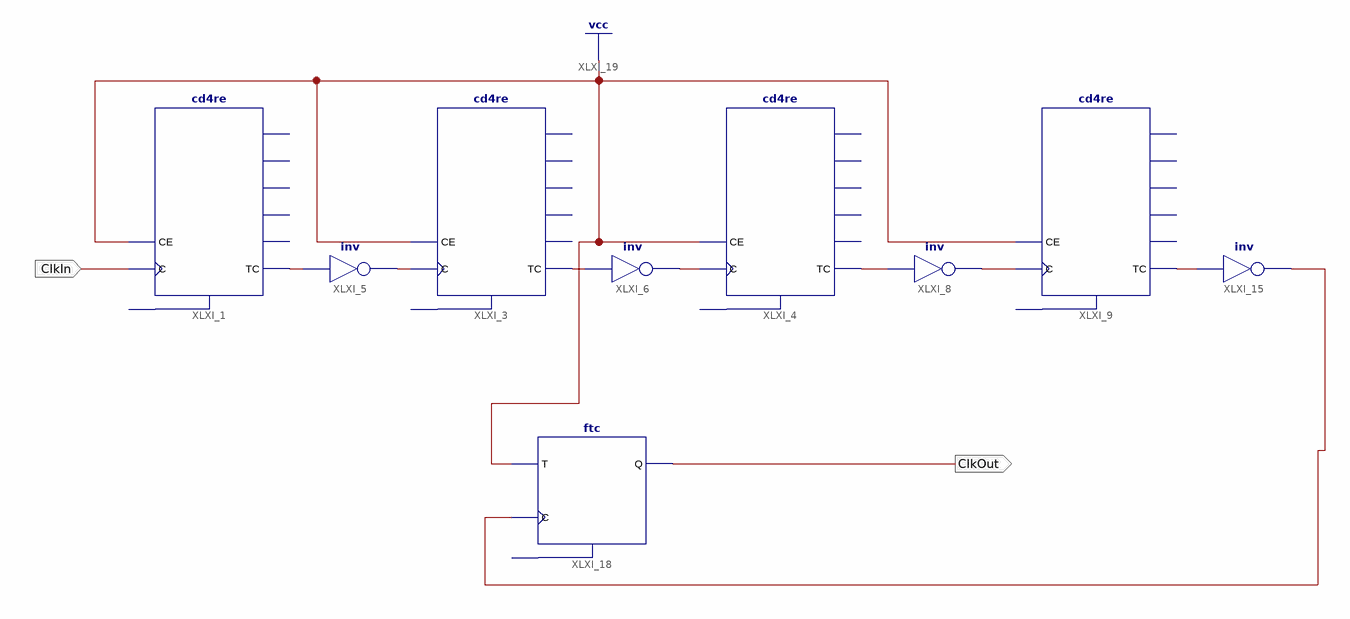
[diagram p0: schematic sheet 1]
// Xilinx ISE schematic clockforsevensegment.sch (spartan6) as structural Verilog: 9 symbols, 2 ports
module clockforsevensegment (
  input  ClkIn,
  output ClkOut
);

  wire XLXN_3, XLXN_4, XLXN_5, XLXN_6, XLXN_19, XLXN_21, XLXN_22, XLXN_35;

  cd4re XLXI_1 (.C(ClkIn), .CE(1'b1), .TC(XLXN_3));  // open: R, CEO, Q0, Q1, Q2, Q3
  cd4re XLXI_3 (.C(XLXN_4), .CE(1'b1), .TC(XLXN_5));  // open: R, CEO, Q0, Q1, Q2, Q3
  cd4re XLXI_4 (.C(XLXN_6), .CE(1'b1), .TC(XLXN_21));  // open: R, CEO, Q0, Q1, Q2, Q3
  not XLXI_5 (XLXN_4, XLXN_3);
  not XLXI_6 (XLXN_6, XLXN_5);
  not XLXI_15 (XLXN_35, XLXN_19);
  not XLXI_8 (XLXN_22, XLXN_21);
  cd4re XLXI_9 (.C(XLXN_22), .CE(1'b1), .TC(XLXN_19));  // open: R, CEO, Q0, Q1, Q2, Q3
  ftc XLXI_18 (.C(XLXN_35), .T(1'b1), .Q(ClkOut));  // open: CLR
endmodule
